# Altium schematic sheet FG Sce[1.1].SchDoc
size A1; SheetNumber: 1; SheetTotal: 1
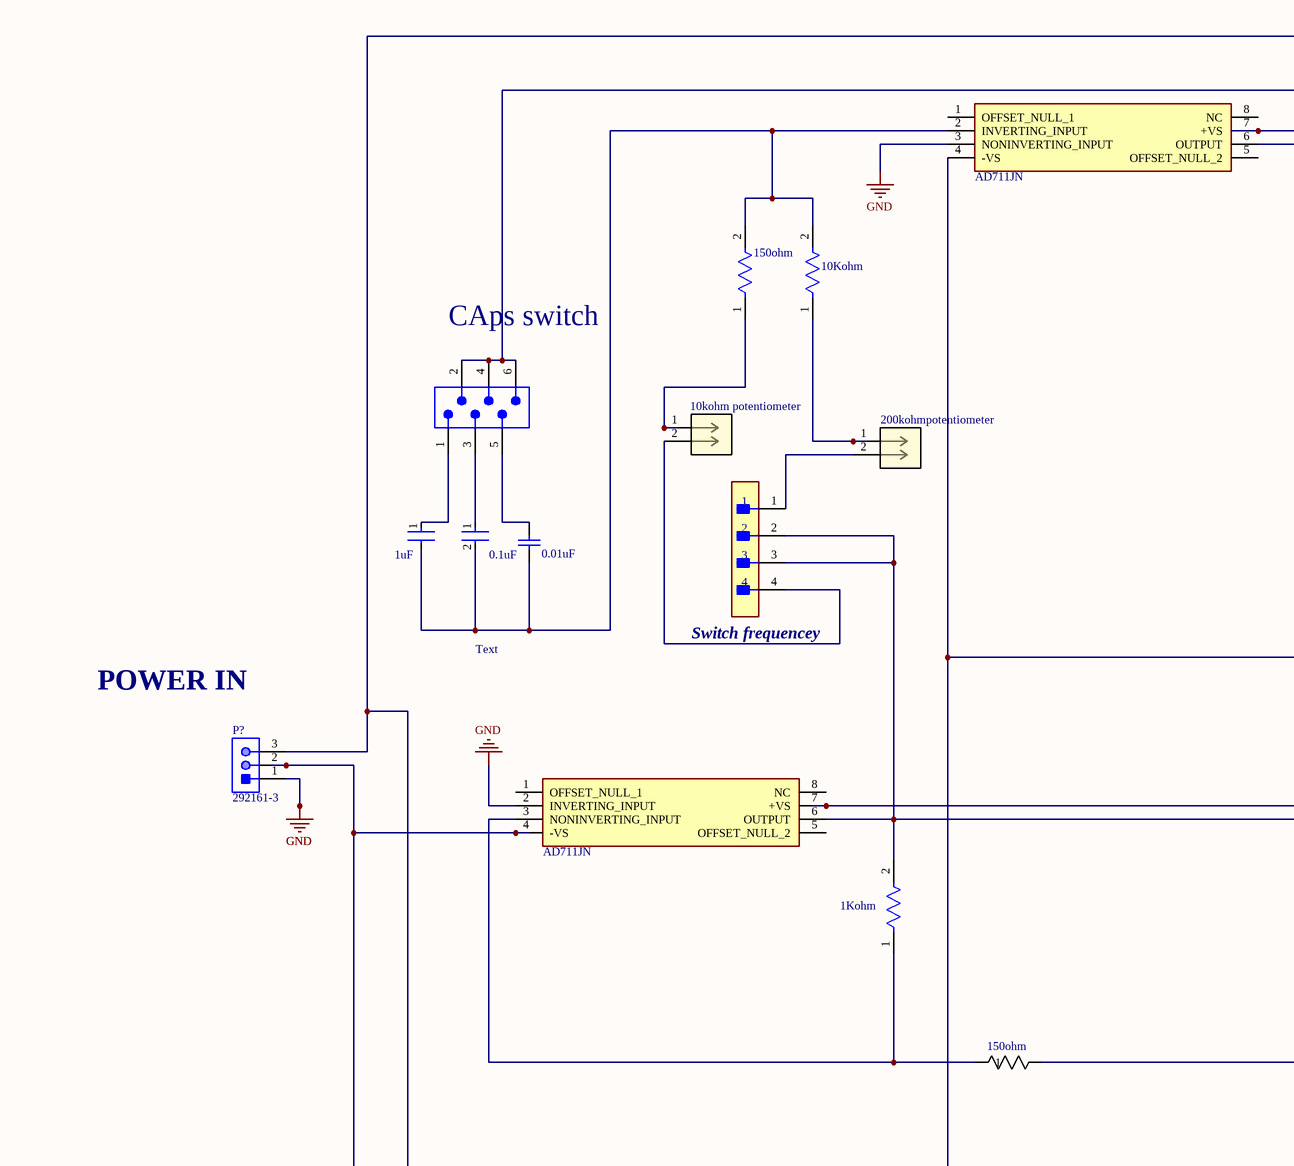
[diagram p0: FG Sce[1.1].SchDoc, top left]
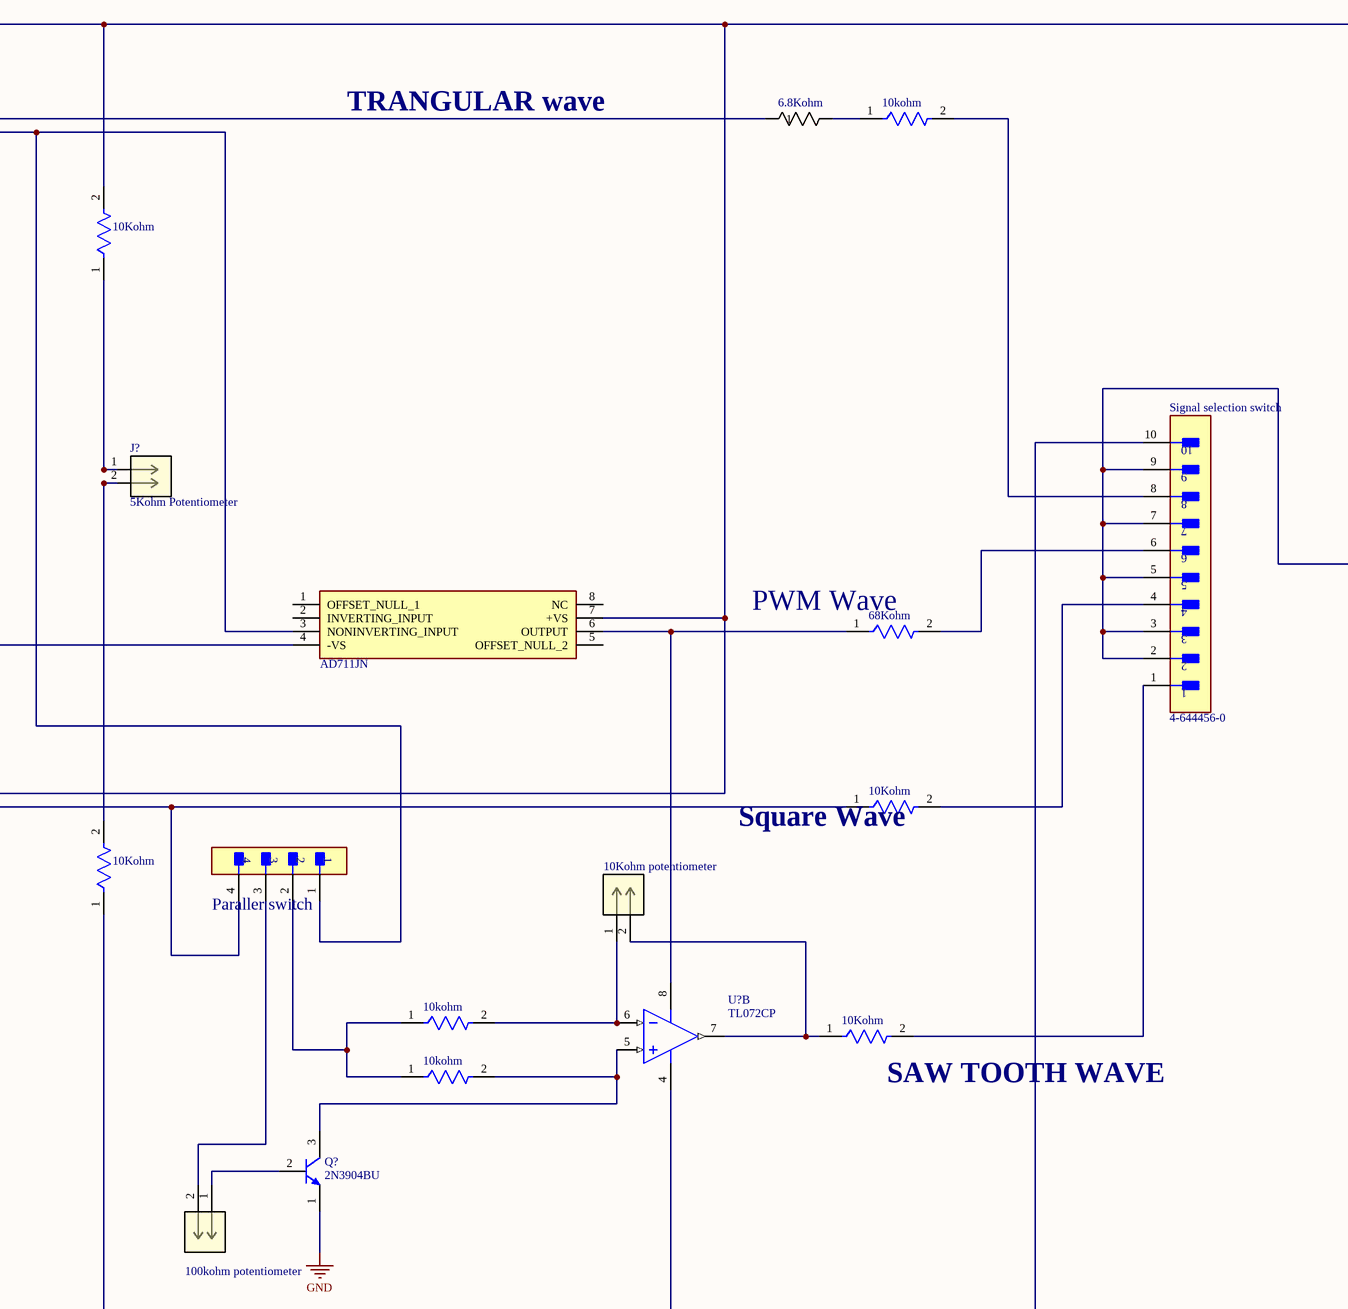
[diagram p1: FG Sce[1.1].SchDoc, top middle]
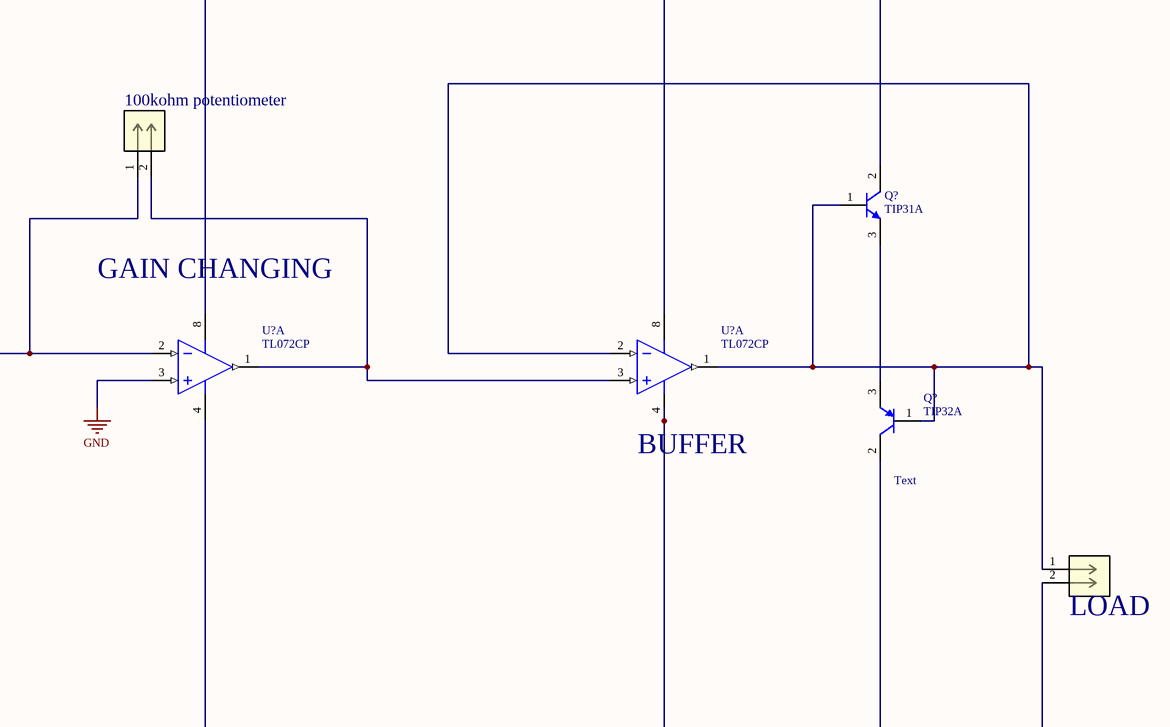
[diagram p2: FG Sce[1.1].SchDoc, top right]
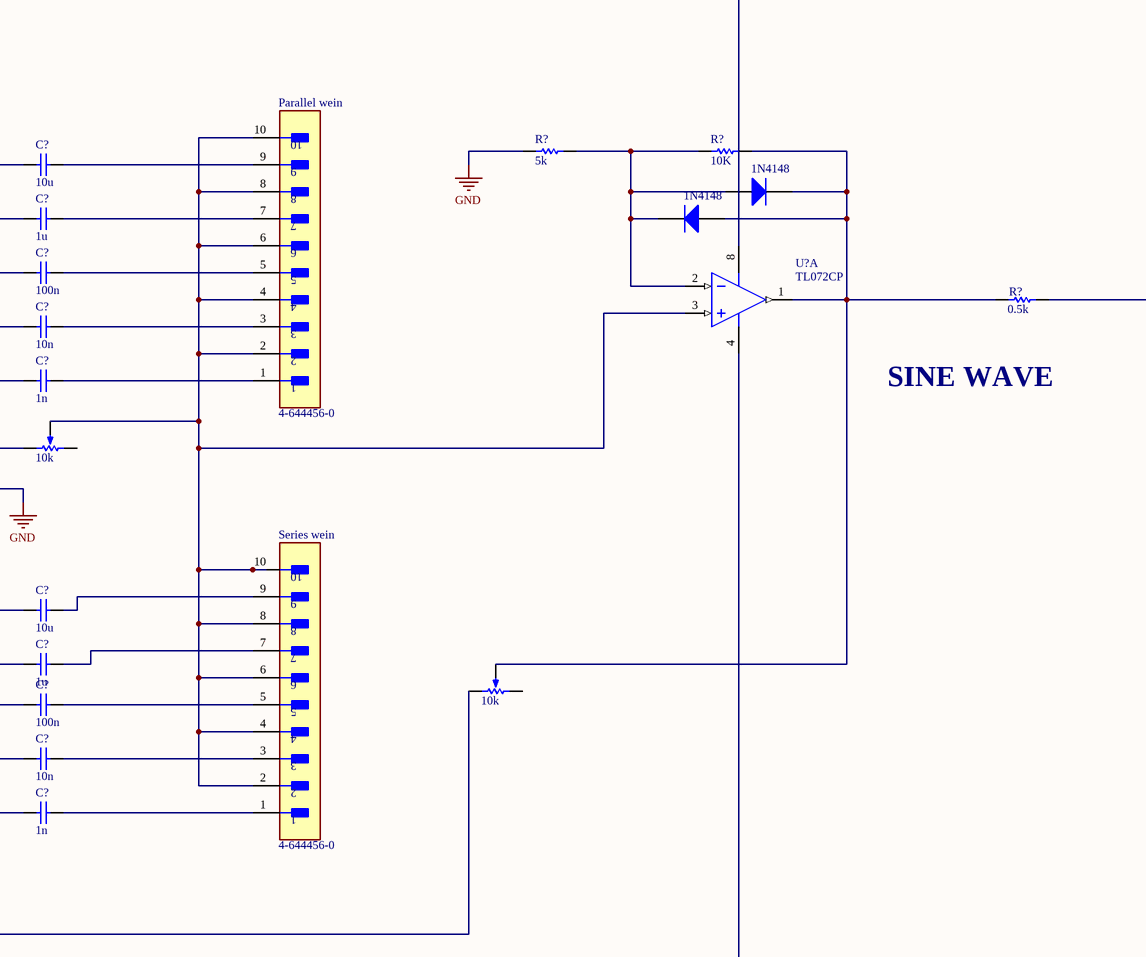
[diagram p3: FG Sce[1.1].SchDoc, bottom middle]
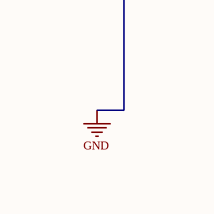
[diagram p4: FG Sce[1.1].SchDoc, bottom right]

## Parts
(Parts that share a designator on the sheet are numbered #1, #2 ... from top to bottom, then left to right.)
1Kohm  PR02000201003JA100  [FP-PR02000201003JA100-MFG]  (value not drawn)
1N4148#1  Diode  (value not drawn)
1N4148#2  Diode  (value not drawn)
6.8Kohm  AC03000001500JAC00  [RES_AC03_VIS]  (value not drawn)
10k#1  Potentiometer  (value not drawn)
10k#2  Potentiometer  (value not drawn)
10kohm#1  MBB02070C1002FCT00  [FP-MBB0207-MFG]  (value not drawn)
10Kohm#2  MBB02070C1002FCT00  [FP-MBB0207-MFG]  (value not drawn)
10Kohm#3  RLR07C7501GSB14  [FP-RLR07-MFG]  (value not drawn)
10Kohm#4  MBB02070C1002FCT00  [FP-MBB0207-MFG]  (value not drawn)
10Kohm#5  MBB02070C1002FCT00  [FP-MBB0207-MFG]  (value not drawn)
10kohm#6  MBB02070C1002FCT00  [FP-MBB0207-MFG]  (value not drawn)
10Kohm#7  MBB02070C1002FCT00  [FP-MBB0207-MFG]  (value not drawn)
10kohm#8  MBB02070C1002FCT00  [FP-MBB0207-MFG]  (value not drawn)
10kohm_potentiometer#1  67997-402HLF  [2Pins_AMP]  (value not drawn)
10Kohm_potentiometer#2  67997-402HLF  [2Pins_AMP]  (value not drawn)
68Kohm  MBB02070C1002FCT00  [FP-MBB0207-MFG]  (value not drawn)
100kohm_potentiometer#1  67997-402HLF  [2Pins_AMP]  (value not drawn)
100kohm_potentiometer#2  67997-402HLF  [2Pins_AMP]  (value not drawn)
150ohm#1  MBB02070C1002FCT00  [FP-MBB0207-MFG]  (value not drawn)
150ohm#2  AC03000001500JAC00  [RES_AC03_VIS]  (value not drawn)
200kohmpotentiometer  67997-402HLF  [2Pins_AMP]  (value not drawn)
?  1uF  [FP-RCE0DB-MFG]
C?#1  0.1uF  [FP-CL956-IPC_C]
C?#2  0.01uF  [KEMT-C333C105M5U5TA-2]
C?#3  value 10u  (hidden comment: Capacitor)
C?#4  value 1u  (hidden comment: Capacitor)
C?#5  value 100n  (hidden comment: Capacitor)
C?#6  value 10n  (hidden comment: Capacitor)
C?#7  value 1n  (hidden comment: Capacitor)
C?#8  value 10u  (hidden comment: Capacitor)
C?#9  value 1u  (hidden comment: Capacitor)
C?#10  value 100n  (hidden comment: Capacitor)
C?#11  value 10n  (hidden comment: Capacitor)
C?#12  value 1n  (hidden comment: Capacitor)
CAps_switch  690357100672  [690357100672]  (value not drawn)
IC?#1  AD711JN  [DIP794W56P254L928H457Q8N]
IC?#2  AD711JN  [DIP794W56P254L928H457Q8N]
IC?#3  AD711JN  [DIP794W56P254L928H457Q8N]
J?  5Kohm Potentiometer  [2Pins_AMP]
LOAD  67997-402HLF  [2Pins_AMP]  (value not drawn)
P?  292161-3  [TECO-292161-3_V]
Parallel_wein  4-644456-0  [FP-4-644456-0-MFG]
Paraller_switch  HTSW-102-07-G-D  [FP-HTSW-102-07-G-D-MFG]  (value not drawn)
Q?#1  TIP31A  [ONSC-TO-220-3-221A-09]
Q?#2  TIP32A  [ONSC-TO-220-3-221A-09]
Q?#3  2N3904BU  [FAIR-TO-92]
R?#1  value 5k  (hidden comment: Resistor)
R?#2  value 10K  (hidden comment: Resistor)
R?#3  value 0.5k  (hidden comment: Resistor)
Series_wein  4-644456-0  [FP-4-644456-0-MFG]
Signal_selection_switch  4-644456-0  [FP-4-644456-0-MFG]
Switch_frequencey  HTSW-102-07-G-D  [FP-HTSW-102-07-G-D-MFG]  (value not drawn)
U?#1  TL072CP  [P0008A]  (part A of 2)
U?#2  TL072CP  [P0008A]  (part A of 2)
U?#3  TL072CP  [P0008A]  (part B of 2)
U?#4  TL072CP  [P0008A]  (part A of 2)

## Nets
GND: 10k#1.2(BOT) C?#3.1 C?#4.1 C?#5.1 C?#6.1 C?#7.1 IC?#1.3(NONINVERTING_INPUT) IC?#3.2(INVERTING_INPUT) LOAD.2 P?.1 Q?#3.1(E) R?#1.1 U?#1.3(IN1+)
Net1Kohm_1: 1Kohm.1 150ohm#2.1 IC?#3.3(NONINVERTING_INPUT)
Net1Kohm_2: 1Kohm.2 10Kohm#4.1 IC?#3.6(OUTPUT) Paraller_switch.4 Switch_frequencey.2 Switch_frequencey.3
Net1N4148#1_1: 1N4148#1.1(A) 1N4148#2.2(K) R?#1.2 R?#2.1 U?#4.2(IN1-)
Net1N4148#1_2: 1N4148#1.2(K) 1N4148#2.1(A) 10k#2.3(TAP) R?#2.2 R?#3.1 U?#4.1(OUT1)
Net6.8Kohm_1: 6.8Kohm.1 IC?#1.7(+VS)
Net6.8Kohm_2: 6.8Kohm.2 10kohm#1.1
Net10k#1_3: 10k#1.3(TAP) Parallel_wein.2 Parallel_wein.4 Parallel_wein.6 Parallel_wein.8 Parallel_wein.10 Series_wein.2 Series_wein.4 Series_wein.6 Series_wein.8 Series_wein.10 U?#4.3(IN1+)
Net10k#2_2: 10k#2.2(BOT) C?#8.1 C?#9.1 C?#10.1 C?#11.1 C?#12.1
Net10kohm#1_2: 10kohm#1.2 Signal_selection_switch.8
Net10Kohm#2_1: 10Kohm#2.1 J?.1
Net10Kohm#2_2: 10Kohm#2.2 IC?#2.7(+VS) IC?#3.7(+VS) P?.3 Q?#1.2(C) U?#1.8(VCC+) U?#2.8(VCC+) U?#4.4(VCC-)
Net10Kohm#3_1: 10Kohm#3.1 200kohmpotentiometer.1
Net10Kohm#3_2: 10Kohm#3.2 150ohm#1.2 ?.2 C?#1.2 C?#2.1 IC?#1.2(INVERTING_INPUT)
Net10Kohm#4_2: 10Kohm#4.2 Signal_selection_switch.4
Net10Kohm#5_1: 10Kohm#5.1 IC?#1.4(-VS) IC?#2.4(-VS) IC?#3.4(-VS) P?.2 Q?#2.2(C) U?#1.4(VCC-) U?#2.4(VCC-) U?#3.4(VCC-) U?#4.8(VCC+)
Net10Kohm#5_2: 10Kohm#5.2 J?.2
Net10kohm#6_1: 10kohm#6.1 10kohm#8.1 Paraller_switch.2
Net10kohm#6_2: 10kohm#6.2 10Kohm_potentiometer#2.1 U?#3.6(IN2-)
Net10Kohm#7_1: 10Kohm#7.1 10Kohm_potentiometer#2.2 U?#3.7(OUT2)
Net10Kohm#7_2: 10Kohm#7.2 Signal_selection_switch.1
Net10kohm#8_2: 10kohm#8.2 Q?#3.3(C) U?#3.5(IN2+)
Net10kohm_potentiometer#1_1: 10kohm_potentiometer#1.1 150ohm#1.1
Net10kohm_potentiometer#1_2: 10kohm_potentiometer#1.2 Switch_frequencey.4
Net68Kohm_1: 68Kohm.1 IC?#2.6(OUTPUT) U?#3.8(VCC+)
Net68Kohm_2: 68Kohm.2 Signal_selection_switch.6
Net100kohm_potentiometer#1_1: 100kohm_potentiometer#1.1 Signal_selection_switch.2 Signal_selection_switch.3 Signal_selection_switch.5 Signal_selection_switch.7 Signal_selection_switch.9 U?#1.2(IN1-)
Net100kohm_potentiometer#1_2: 100kohm_potentiometer#1.2 U?#1.1(OUT1) U?#2.3(IN1+)
Net100kohm_potentiometer#2_1: 100kohm_potentiometer#2.1 Q?#3.2(B)
Net100kohm_potentiometer#2_2: 100kohm_potentiometer#2.2 Paraller_switch.3
Net150ohm#2_2: 150ohm#2.2 CAps_switch.2 CAps_switch.4 CAps_switch.6 IC?#1.6(OUTPUT) IC?#2.3(NONINVERTING_INPUT) Paraller_switch.1
Net200kohmpotentiometer_2: 200kohmpotentiometer.2 Switch_frequencey.1
Net?_1: ?.1 CAps_switch.1
NetC?#1_1: C?#1.1 CAps_switch.3
NetC?#2_2: C?#2.2 CAps_switch.5
NetC?#3_2: C?#3.2 Parallel_wein.9
NetC?#4_2: C?#4.2 Parallel_wein.7
NetC?#5_2: C?#5.2 Parallel_wein.5
NetC?#6_2: C?#6.2 Parallel_wein.3
NetC?#7_2: C?#7.2 Parallel_wein.1
NetC?#8_2: C?#8.2 Series_wein.9
NetC?#9_2: C?#9.2 Series_wein.7
NetC?#10_2: C?#10.2 Series_wein.5
NetC?#11_2: C?#11.2 Series_wein.3
NetC?#12_2: C?#12.2 Series_wein.1
NetLOAD_1: LOAD.1 Q?#1.1(B) Q?#2.1(B) U?#2.1(OUT1) U?#2.2(IN1-)
NetQ?#1_3: Q?#1.3(E) Q?#2.3(E)
NetR?#3_2: R?#3.2 Signal_selection_switch.10

Not connected (* = marked no-connect by the designer): 10k#1 1(TOP); 10k#2 1(TOP); IC?#1 1(OFFSET_NULL_1) 5(OFFSET_NULL_2) 8(NC); IC?#2 1(OFFSET_NULL_1) 2(INVERTING_INPUT) 5(OFFSET_NULL_2) 8(NC); IC?#3 1(OFFSET_NULL_1) 5(OFFSET_NULL_2) 8(NC)

## Notes on the sheet
- TRANGULAR wave
- GAIN CHANGING
- Text
- (near 68Kohm) PWM Wave
- POWER IN
- (near U?#2) BUFFER
- (near Q?#2) Text
- (near 10Kohm#4) Square Wave
- (near 10Kohm#7) SAW TOOTH WAVE
- SINE WAVE

## Library data of the parts
1Kohm = CMP-00030-42817933-1: PR02000201003JA100 Fixed Resistor, Metal Film, 2W, 100000ohm, 500V, 5% +/-Tol, 250ppm/Cel, Through Hole Mount; Resistance: 100kΩ; Temperature Coefficient: 250ppm/°C; Case/Package: Conformal; Lead Free: Lead Free; Composition: Metal Film; Schedule B: 8533210090, 8533210090; Tolerance: 5%; RoHS: Compliant; Min Operating Temperature: -55°C; NexarPartId: 42817933; Diameter: 3.9mm; Max Operating Temperature: 155°C; Voltage Rating: 500V; Length: 12mm; Width: 3.9mm; Contact Plating: Tin; REACH SVHC: No SVHC; Operating Supply Voltage: 500V; Termination: Axial; Power Rating: 2W; Military Standard: Not; Radiation Hardening: No; Mount: Through Hole; Voltage Rating (DC): 500V
1N4148#1 1N4148#2 = Diode: AF: 1; BV: 0; BV_MAX: 1e99; EG: 1.11; FC: 0.5; IBV: 0.001; ISR: 1e-14; MJSW: 0.33; NTUN: 30; TNOM: 27; XTI: 3; SimulationGenericComponent: True; CJO: 0; CJP: 0; CTA: 0; CTP: 0; FCS: 0.5; FV_MAX: 1e99; IKF: 0; IKR: 0; JSW: 0; JTUN: 0; JTUNSW: 0; KEG: 1; KF: 0; LEVEL: 1; N: 1; NBV: 1; NR: 1; NS: 1; PHP: 1; RS: 0; TCV: 0; TLEV: 0; TLEVC: 0; TM1: 0; TM2: 0; TPB: 0; TPHP: 0; TRS: 0; TRS2: 0; TT: 0; TTT1: 0; TTT2: 0; VJ: 1; XTITUN: 3; IS: 1e-14
6.8Kohm 150ohm#2 = CMP-00030-39746975-1: AC03000001500JAC00 VISHAY AC03000001500JAC00 Through Hole Resistor, 150 ohm, Axial Leaded, 3 W, 5%, AC Series; Resistance: 150Ω; Voltage Rating (DC): 21V; Lead Diameter: 800µm; Power Rating: 3W; Temperature Coefficient: -80ppm/°C; Contact Plating: Tin; Min Operating Temperature: 0°C; Schedule B: 8533210080; Composition: Wirewound; Features: Flame Retardant Coating; RoHS: Compliant; Width: 4.8mm; Lead Free: Lead Free; Number of Pins: 2; Radiation Hardening: No; Length: 13mm; Packaging: Cut Tape (CT); Termination: Axial; REACH SVHC: Unknown; Case/Package: Conformal; NexarPartId: 39746975; Diameter: 4.8mm; Military Standard: Not; Number of Terminations: 2; Max Operating Temperature: 275°C; Max Power Dissipation: 3W; Tolerance: 5%
10k#1 10k#2 = Potentiometer: value: 1k; position: 0.5; SimulationGenericComponent: True
10kohm#1 10Kohm#2 10Kohm#4 10Kohm#5 10kohm#6 10Kohm#7 10kohm#8 68Kohm 150ohm#1 = CMP-02408-000035-1: RES 10K OHM 0.6W 1% AXIAL; Voltage Rating: 300V; Resistance: 10kR; Max Power Dissipation: 600mW; Temperature Coefficient: 50ppm/°C; Radiation Hardening: No; Case/Package: Conformal; Termination: Axial; Military Standard: Not; Length: 6.5mm; Voltage Rating (DC): 300V; RoHS Compliant: Yes; Number of Terminations: 2; Packaging: Tape and Reel; Features: Automotive AEC-Q200; Tolerance: 1%; Min Operating Temperature: -55°C; Power Rating: 600mW; Lead Free: Lead Free; Resistor Type: Metal Film; Construction: Cylindrical; Series: MBB 0207 - Professional; Max Operating Temperature: 155°C; Diameter: 2.5mm; Resistance Tolerance: 1%; Contact Plating: Tin; Technology: THIN FILM
10Kohm#3 = CMP-00030-41139779-1: RLR07C7501GSB14 Res Metal Film 7.5K Ohm 2% 1/4W ±100ppm/°C 0.001% Conformal AXL Thru-Hole Bulk; Resistance: 7.5kΩ; Voltage Rating: 250V; Power Rating: 250mW; Military Standard: MIL-PRF-39017; Tolerance: 2%; Width: 2.29mm; Case/Package: Axial; Failure Rate: 0.001%; Composition: Metal Film; Height: 2.5mm; Max Operating Temperature: 150°C; Termination: Axial; Schedule B: 8533210090, 8533210090; Number of Terminations: 2; Voltage Rating (DC): 250V; RoHS: Non-Compliant; Mount: Through Hole; Packaging: Bulk; Features: Military, Moisture Resistant, Weldable; Min Operating Temperature: -65°C; Length: 7.62mm; Diameter: 2.29mm; Lead Free: Contains Lead; Max Power Dissipation: 250mW; Temperature Coefficient: 100ppm/°C; Contact Plating: Lead, Tin; NexarPartId: 41139779
10kohm_potentiometer#1 10Kohm_potentiometer#2 100kohm_potentiometer#1 100kohm_potentiometer#2 200kohmpotentiometer J? LOAD = 67997-402HLF: No Description Available; Mfr_Name: Amphenol ICC; RefDes: RefDes; Type: Type
? = CMP-06035-006081-1: Cap Ceramic 10nF 100V X7R ±10% Radial 2.5mm +125°C Ammo Pack; Lead Diameter: 0.5mm; Lead/Base Style: Straight; Mount: Through Hole; Package Quantity: 2000; Ratings: AEC-Q200; Dielectric: X7R; Width: 0.098inch; Resistor Type: Ceramic; Voltage Rating: 100V; Termination: Radial; Voltage Rating (DC): 100V; Packaging: Tape and Reel; Capacitance: 10nF; Length: 0.142inch; Case/Package: Radial; Min Operating Temperature: -55°C; Max Operating Temperature: 125°C; Height - Seated (Max): 0.138inch; Height: 3.5mm; Lead Pitch: 0.098inch; Tolerance: 10%
C?#1 = CMP-13271-003618-1: Cap Ceramic 1nF 50V X7R ±5% SMD 0402 +125°C Paper T/R; Width: 0.02inch; Capacitance: 1nF; Length: 0.039inch; Packaging: Tape and Reel; Min Operating Temperature: -55°C; Case/Package: 0402; Package Quantity: 1; Mount: Surface Mount; Tolerance: 5%; Max Operating Temperature: 125°C; Voltage Rating: 50V; Case Code (Imperial): 0402; Thickness: 0.022inch; Case Code (Metric): 1005
C?#2 = CMP-2000-05174-1: Multilayer Ceramic Capacitor / Axial and Radial Leaded, 1 uF, +/- 20%, 10 to 85 degC, 2-Pin THD, RoHS, Bulk; Manufacturer: Kemet; Voltage Rating: 50V; Temperature Coefficient / Code: Z5U; Case Height: 3.81mm; Lead Diameter: 0.51mm; Case Style: ConformallyCoated; Dissipation Factor DF: 4; Capacitance: 1uF; Case Length: 9.91mm; Type: RadialLeads; Case Width: 7.62mm; Dimensions: 7.62mmWx9.91mmLx3.81mmH; Termination Style: Radial; Factory Pack Quantity: 250; Packaging: Bulk; RoHS: Details; Datasheet Version: Jul-09; Lead Spacing: 5.08mm; Product Category: MultilayerCeramicCapacitorsMLCC-Leaded; Maximum Operating Temperature: +125C; Product: GeneralTypeMLCCs; Manufacturer URL: http://www.kemet.com/; Lead Style: InsideBend; Operating Temperature Range: -55Cto+125C; Datasheet URL: http://www.farnell.com/datasheets/706880.pdf; Voltage Rating DC: 50V; Brand: Kemet; Series: C333; Tolerance: 20%; Minimum Operating Temperature: -55C
C?#3-C?#12 = Capacitor: SimulationGenericComponent: True
CAps_switch = CMP-1502-00902-2: NexarPartId: 8917654; Contact Resistance: 10mΩ; Number of Positions: 6; Gender: Male; Row Spacing: 2.54mm; Current Rating: 1.5A; Connector Type: Male Pin; Insulation: Insulated; Insulation Resistance: 1GΩ; Voltage Rating: 100V; Length: 9.65mm; Mount: Through Hole; Lead Pitch: 2.54mm; Orientation: Straight; Min Operating Temperature: -40°C; Max Operating Temperature: 105°C; Insulation Material: PBT; Termination: Through Hole; REACH SVHC: Unknown; Pitch: 2.54mm; Number of Rows: 2; Color: Red; Contact Plating: Tin; Flammability Rating: UL94 V-0; Housing Material: PBT; Number of Pins: 6; Contact Material: Bronze; Number of Contacts: 6; RoHS: Compliant; Contact Gender: Male; Operating Supply Voltage: 100V; Height: 7mm
IC?#1-IC?#3 = AD711JN: Integrated Circuit; Manufacturer_Name: Analog Devices; Datasheet Link: https://www.analog.com/media/en/technical-documentation/data-sheets/AD711.pdf; Height: 4.57mm; Manufacturer_Part_Number: AD711JN
P? = CMP-2000-05551-1: Male Header, Pitch 2 mm, 1 x 3 Position, Height 6.8 mm, Tail Length 3.2 mm, -40 to 105 degC, RoHS, Bulk; Manufacturer: TE Connectivity; SVHC: NoSVHC(15-Jun-2015); Pitch Spacing: 2mm; Contact Termination Type: ThroughHole; No. of Rows: 1Rows; No. of Contacts: 3Contacts; Product Range: AMPCTSeries; Mounting Technology: ThroughHole; Manufacturer URL: http://www.te.com/; Contact Material: Brass; Datasheet URL: http://www.te.com/commerce/DocumentDelivery/DDEController?Action=showdoc&DocId=Customer+Drawing%7F292161%7FP1%7Fpdf%7FEnglish%7FENG_CD_292161_P1.pdf%7F292161-3; Package Reference: 292161-3; Contact Plating: TinPlatedContacts; Gender: Header; Datasheet Version: Rev. P1, 06/2016; Package Description: Male Header, Pitch 2 mm, 1 x 3 Position, Height 6.8 mm, Tail Length 3.2 mm
Parallel_wein Series_wein Signal_selection_switch = CMP-03369-000038-1: CONN HEADER VERT 10POS 2.54MM; Manufacturer: TE Connectivity; Current Rating: 5A; Conn Gender: Male; Number Of Contacts: 10; Conn Orientation: Vertical; Voltage Rating: 250V; Number Of Rows: 1; Device Class L3: unset; Octopart: https://octopart.com/4-644456-0-te+connectivity-39514173; Pitch: 2.54mm; Mouser Description: Headers & Wire Housings NARROW FLT HDR 10P Straight Post; ComponentLink2Description: Datasheet; Height: 0.408inch; Package: 4-644456-0; RoHS: TRUE; Temperature Range High: +105°C; Digikey Description: CONN HEADER VERT 10POS 2.54MM; Temperature: -55°C to +105°C; Device Class L2: Headers and Wire Housings; Automotive: No; Lead Free: Yes; Contact Material: Tin; Manufacturer Part Number: 4-644456-0; Temperature Range Low: -55°C; Footprint Url: https://www.te.com/commerce/DocumentDelivery/DDEController?Action=showdoc&DocId=Customer+Drawing%7F644456%7FD2%7Fpdf%7FEnglish%7FENG_CD_644456_D2.pdf%7F4-644456-0; Device Class L1: Connectors; Category: Conn; ComponentLink2URL: https://www.te.com/commerce/DocumentDelivery/DDEController?Action=showdoc&DocId=Data+Sheet%7F82056_MTA%7F0818%7Fpdf%7FEnglish%7FENG_DS_82056_MTA_0818.pdf%7F4-644456-0
Paraller_switch Switch_frequencey = CMP-02766-000010-1: CONN HEADER VERT 4POS 2.54MM; Manufacturer: Samtec; Voltage Rating: 550V; Conn Orientation: Straight; Number Of Contacts: 4; Conn Gender: Male; Current Rating: 6.3A; Number Of Rows: 2; Category: Conn; Temperature: -55°C to +125°C; Automotive: No; Digikey Description: CONN HEADER VERT 4POS 2.54MM; ComponentLink2URL: http://suddendocs.samtec.com/catalog_english/htsw_th.pdf; Device Class L2: Headers and Wire Housings; Mouser Description: Conn Unshrouded Header HDR 4 POS 2.54mm Solder ST Thru-Hole Bag; Manufacturer Part Number: HTSW-102-07-G-D; Temperature Range High: +125°C; Contact Material: Gold,Nickel; Temperature Range Low: -55°C; ComponentLink2Description: Datasheet; Device Class L1: Connectors; Pitch: 2.54mm; Octopart: https://octopart.com/htsw-102-07-g-d-samtec-10531767; RoHS: TRUE; Package: HTSW-102-07-G-D; Lead Free: Yes; Device Class L3: unset; Height: 8.71mm
Q?#1 = CMP-1048-01124-1: Complementary Silicon Plastic Power Transistor, 3-Pin TO-220, Tube; Manufacturer: On Semiconductor; IC Continuous (A): 3; Polarity: NPN; ComponentLink2Description: Datasheet; Mounting Technology: Through Hole; DatasheetVersion: Rev. 14; ComponentLink1URL: http://www.onsemi.com/; PackageReference: TO-220-3-221A-09; ComponentLink3URL: http://www.onsemi.com/pub_link/Collateral/221A-09.PDF; Packing: Tube; PartNumber: TIP31A; ComponentLink3Description: Package Specification; ComponentLink1Description: Manufacturer URL; PackageVersion: Rev. AG, 09/2011; ComponentLink2URL: http://www.onsemi.com/pub_link/Collateral/TIP31A-D.PDF; PackageDescription: 3-Pin Flange Mount, Vertical Straight Lead, Body 9.97 x 4.445 mm, Pitch 2.54 mm; fT Min (MHz): 3; RoHS: FALSE
Q?#2 = CMP-1048-01079-1: Complementary Silicon Plastic Power Transistor, 3-Pin TO-220, Tube; Manufacturer: On Semiconductor; Polarity: PNP; IC Continuous (A): 3; ComponentLink3Description: Package Specification; ComponentLink2URL: http://www.onsemi.com/pub_link/Collateral/TIP31A-D.PDF; PackageDescription: 3-Pin Flange Mount, Vertical Straight Lead, Body 9.97 x 4.445 mm, Pitch 2.54 mm; PackageVersion: Rev. AG, 09/2011; Mounting Technology: Through Hole; RoHS: FALSE; ComponentLink1URL: http://www.onsemi.com/; ComponentLink2Description: Datasheet; PackageReference: TO-220-3-221A-09; fT Min (MHz): 3; ComponentLink1Description: Manufacturer URL; PartNumber: TIP32A; DatasheetVersion: Rev. 14; Packing: Tube; ComponentLink3URL: http://www.onsemi.com/pub_link/Collateral/221A-09.PDF
Q?#3 = CMP-2000-04944-1: NPN General-Purpose Amplifier, 40 V VCEO, 0.2 A, -55 to 150 degC, 2-Pin TO-92, RoHS, Bulk; Manufacturer: FairchildSemiconductor; Maximum Collector Base Voltage: 60V; Minimum DC Current Gain: 40@0.1mA@1V; Maximum Collector Emitter Voltage: 40V; Maximum DC Collector Current: 0.2A; Rad Hard: No; Maximum Operating Frequency: 300(Min)MHz; Maximum Collector Emitter Saturation Voltage: 0.2@1mA@10mA; Maximum Power Dissipation: 625mW; Package Description: 3-Pin Transistor Outline Package, Body Dia 4.79 mm, Pitch 1.27 mm; Package Reference: TO-92; Pin Count: 3; Operating Temperature: -55to150degC; Category: GPBJT; Manufacturer URL: https://www.fairchildsemi.com/; Datasheet URL: https://datasheet.ciiva.com/4722/2n3904-82270-4722369.pdf; Package: 3TO-92; Packaging: Bulk; Type: NPN; Datasheet Version: Rev. 1.1.0, 10/2014; Mounting: ThroughHole
R?#1-R?#3 = Resistor: TC1: 0; SimulationGenericComponent: True; TC2: 0
U?#1-U?#4 = CMP-0017-00950-2: Dual Low-Noise JFET-Input General-Purpose Operational Amplifier, 7 to 36 V, 0 to 70 degC, 8-pin DIP (P8), Pb-Free (RoHS); Manufacturer: Texas Instruments; Sub Family: General Purpose Amplifier, High Supply Voltage Amplifier (>=30V); Total Supply Voltage(Max)(+5V is 5, +/-5V is 10): 36; Slew Rate(Typ)(V/us): 13; Vn at 1kHz(Typ)(nV/rtHz): 18; GBW(Typ)(MHz): 3; CMRR(Min)(dB): 70; Total Supply Voltage(Min)(+5V is 5, +/-5V is 10): 7; Vio (25C)(Max)(mV): 10; Rating: Catalog; IIB(Max)(pA): 200; Iq per channel(Max)(mA): 2.5; Number of Channels: 2; Mounting Technology: Through Hole; ComponentLink3Description: Package Specification; PartNumber: TL072CP; PackageVersion: 4040082/E, 04/2010; Eco-Plan: Pb-Free (RoHS); DatasheetVersion: SLOS080J; Offset Drift(Typ)(uV/C): 18; ComponentLink3URL: http://www.ti.com/litv/pdf/mpdi001b; PackageDescription: 8-Pin Plastic In-Line, Body 9.59 x 6.35 mm, Pitch 2.54 mm; Code_JEDEC: MS-001; ComponentLink2URL: http://www.ti.com/lit/ds/symlink/tl072.pdf; ComponentLink1Description: Manufacturer URL; ComponentLink2Description: Datasheet; ComponentLink1URL: http://www.ti.com/; PackageReference: P0008A